# Altium schematic sheet MCU_board_3.SchDoc
size A4; SheetNumber: 3; SheetTotal: 3
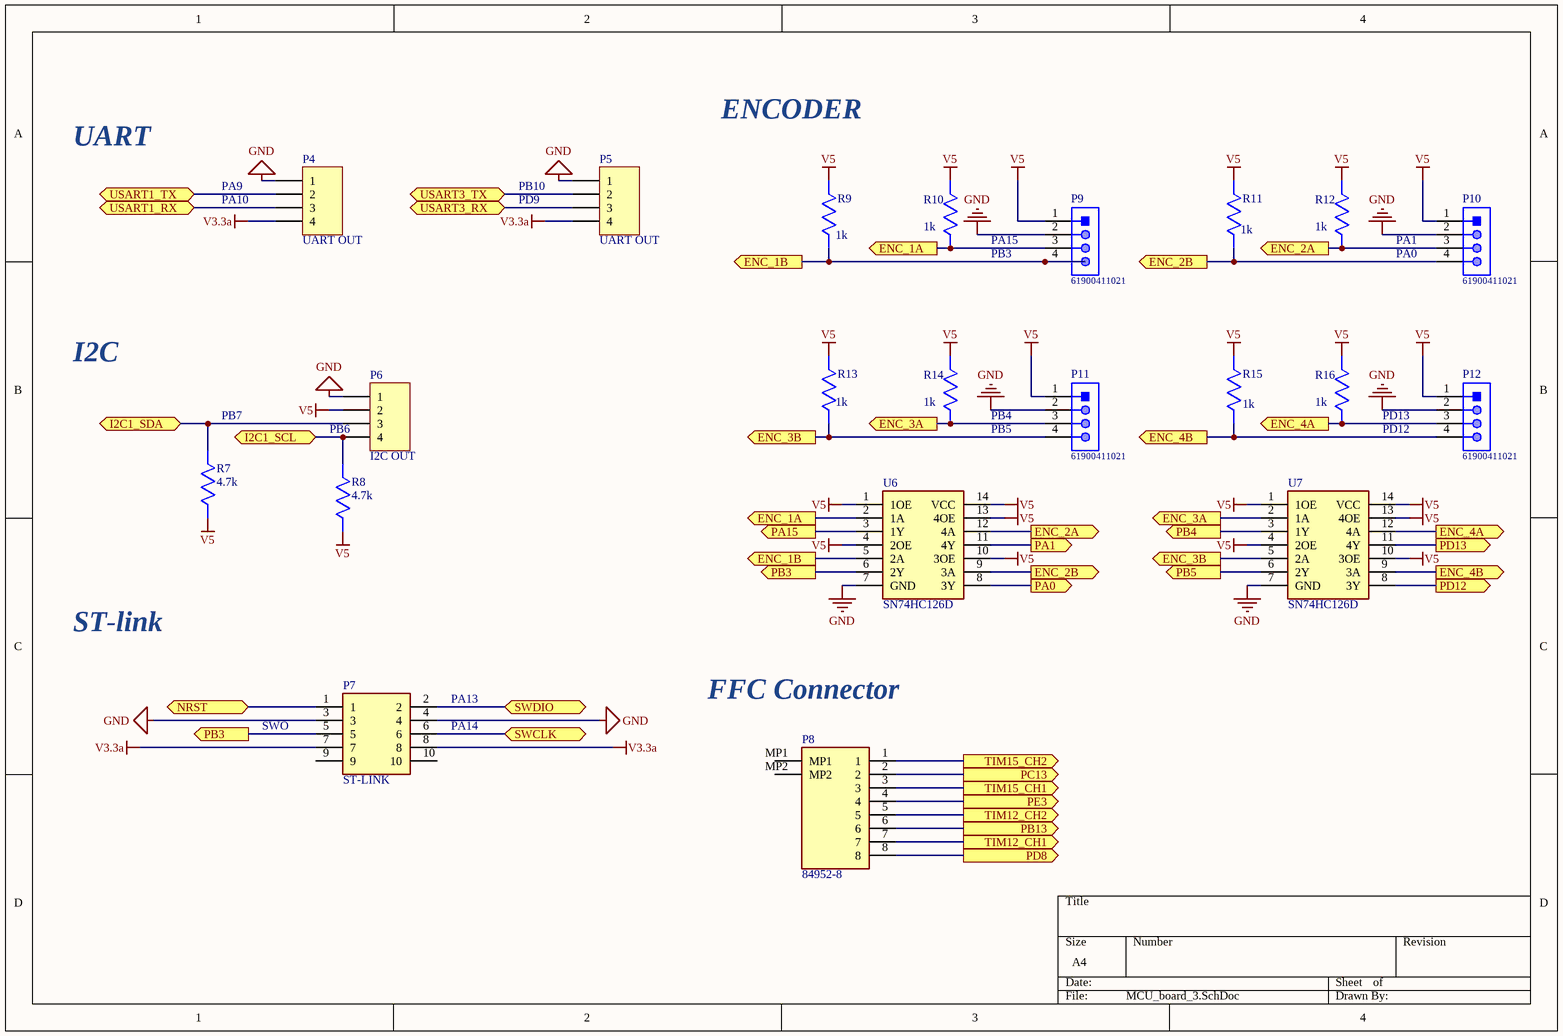
[diagram p0: MCU_board_3.SchDoc]

## Parts
P4  UART OUT  [HDR1X4]
P5  UART OUT  [HDR1X4]
P6  I2C OUT  [HDR1X4]
P7  ST-LINK  [SHDR10W66P254_2X5_2035X880X920P]
P8  84952-8  [849528]
P9  61900411021  [61900411021]
P10  61900411021  [61900411021]
P11  61900411021  [61900411021]
P12  61900411021  [61900411021]
R7  4.7k  [RESC1608X55N]
R8  4.7k  [RESC1608X55N]
R9  1k  [RESC1608X55N]
R10  1k  [RESC1608X55N]
R11  1k  [RESC1608X55N]
R12  1k  [RESC1608X55N]
R13  1k  [RESC1608X55N]
R14  1k  [RESC1608X55N]
R15  1k  [RESC1608X55N]
R16  1k  [RESC1608X55N]
U6  SN74HC126D  [SOIC127P600X175-14N]
U7  SN74HC126D  [SOIC127P600X175-14N]

## Ports
ENC_1A (out, see MCU_board_3[2C]), ENC_1A (out, see MCU_board_3[3A]), ENC_1B (out, see MCU_board_3[2B]), ENC_1B (out, see MCU_board_3[2C]), ENC_2A (out, see MCU_board_3[3C]), ENC_2A (out, see MCU_board_3[4A]), ENC_2B (out, see MCU_board_3[3B]), ENC_2B (out, see MCU_board_3[3C]), ENC_3A (out, see MCU_board_3[3B]), ENC_3A (out, see MCU_board_3[3C]), ENC_3B (out, see MCU_board_3[2B]), ENC_3B (out, see MCU_board_3[3C]), ENC_4A (out, see MCU_board_3[4B]), ENC_4A (out, see MCU_board_3[4C]), ENC_4B (out, see MCU_board_3[3B]), ENC_4B (out, see MCU_board_3[4C]), I2C1_SCL (bidir, see MCU_board_1[1D]), I2C1_SDA (bidir, see MCU_board_1[1D]), NRST (bidir, see MCU_board_1[3A], MCU_board_2[1C], MCU_board_2[2C]), PA0 (out, see MCU_board_1[1C]), PA1 (out, see MCU_board_1[1C]), PA15 (out, see MCU_board_1[1C]), PB3 (out, see MCU_board_1[1D], MCU_board_3[1C]), PB3 (out, see MCU_board_1[1D], MCU_board_3[2C]), PB4 (out, see MCU_board_1[1D]), PB5 (out, see MCU_board_1[1D]), PB13 (out, see MCU_board_1[1D]), PC13 (out, see MCU_board_1[2C]), PD8 (out, see MCU_board_1[2D]), PD12 (out, see MCU_board_1[2D]), PD13 (out, see MCU_board_1[2D]), PE3 (out, see MCU_board_1[2A]), SWCLK (bidir, see MCU_board_1[1C]), SWDIO (bidir, see MCU_board_1[1C]), TIM12_CH1 (out, see MCU_board_1[1D]), TIM12_CH2 (out, see MCU_board_1[1D]), TIM15_CH1 (out, see MCU_board_1[2A]), TIM15_CH2 (out, see MCU_board_1[2A]), USART1_RX (bidir, see MCU_board_1[1C], MCU_board_2[4C]), USART1_TX (bidir, see MCU_board_1[1C], MCU_board_2[4C]), USART3_RX (bidir, see MCU_board_1[2D]), USART3_TX (bidir, see MCU_board_1[1D])

## Nets
GND: P4.1 P5.1 P6.1 P7.3 P7.4 P9.2 P10.2 P11.2 P12.2 U6.7(GND) U7.7(GND)
V3.3a: P4.4 P5.4 P7.7 P7.8
V5: P6.2 P9.1 P10.1 P11.1 P12.1 R7.1 R8.1 R9.2 R10.2 R11.2 R12.2 R13.2 R14.2 R15.2 R16.2 U6.1(1OE) U6.4(2OE) U6.10(3OE) U6.13(4OE) U6.14(VCC) U7.1(1OE) U7.4(2OE) U7.10(3OE) U7.13(4OE) U7.14(VCC)
ENC_1A: P9.3 R10.1 U6.2(1A) ; port ENC_1A
ENC_1B: P9.4 R9.1 U6.5(2A) ; port ENC_1B
ENC_2A: P10.3 R12.1 U6.12(4A) ; port ENC_2A
ENC_2B: P10.4 R11.1 U6.9(3A) ; port ENC_2B
ENC_3A: P11.3 R14.1 U7.2(1A) ; port ENC_3A
ENC_3B: P11.4 R13.1 U7.5(2A) ; port ENC_3B
ENC_4A: P12.3 R16.1 U7.12(4A) ; port ENC_4A
ENC_4B: P12.4 R15.1 U7.9(3A) ; port ENC_4B
I2C1_SCL: P6.4 R8.2 ; port I2C1_SCL
I2C1_SDA: P6.3 R7.2 ; port I2C1_SDA
NRST: P7.1 ; port NRST
PA0: U6.8(3Y) ; port PA0
PA1: U6.11(4Y) ; port PA1
PA15: U6.3(1Y) ; port PA15
PB3: P7.5 U6.6(2Y) ; port PB3
PB4: U7.3(1Y) ; port PB4
PB5: U7.6(2Y) ; port PB5
PB13: P8.6 ; port PB13
PC13: P8.2 ; port PC13
PD8: P8.8 ; port PD8
PD12: U7.8(3Y) ; port PD12
PD13: U7.11(4Y) ; port PD13
PE3: P8.4 ; port PE3
SWCLK: P7.6 ; port SWCLK
SWDIO: P7.2 ; port SWDIO
TIM12_CH1: P8.7 ; port TIM12_CH1
TIM12_CH2: P8.5 ; port TIM12_CH2
TIM15_CH1: P8.3 ; port TIM15_CH1
TIM15_CH2: P8.1 ; port TIM15_CH2
USART1_RX: P4.3 ; port USART1_RX
USART1_TX: P4.2 ; port USART1_TX
USART3_RX: P5.3 ; port USART3_RX
USART3_TX: P5.2 ; port USART3_TX

Not connected (* = marked no-connect by the designer): P7 9 10; P8 MP1 MP2

## Notes on the sheet
- UART
- ENCODER
- PA9
- PA10
- PB10
- PD9
- PA15
- PA1
- PB3
- PA0
- I2C
- (near R7) PB7
- (near P6) PB6
- PB4
- PB5
- PD13
- PD12
- ST-link
- (near P7) PA13
- FFC Connector
- SWO
- (near P7) PA14

## Library data of the parts
P4-P6 = Header 4: Header, 4-Pin; LatestRevisionDate: 17-Jul-2002; LatestRevisionNote: Re-released for DXP Platform.; Publisher: Altium Limited
P7 = 1-1634688-0: Connector; Manufacturer_Name: TE Connectivity; Datasheet Link: https://componentsearchengine.com/Datasheets/2/1-1634688-0.pdf; Height: 9.2mm; Manufacturer_Part_Number: 1-1634688-0
P8 = 84952-8: Connector; Manufacturer_Name: TE Connectivity; Datasheet Link: https://www.te.com/commerce/DocumentDelivery/DDEController?Action=showdoc&DocId=Customer+Drawing%7F84952%7FA4%7Fpdf%7FEnglish%7FENG_CD_84952_A4.pdf%7F84952-8; Height: 2.74mm; Manufacturer_Part_Number: 84952-8; Mouser Part Number: 571-84952-8; Mouser Price/Stock: https://www.mouser.co.uk/ProductDetail/TE-Connectivity/84952-8?qs=uUkeXfjQ8uTKEYAHE0dNDQ%3D%3D; Arrow Part Number: 84952-8; Arrow Price/Stock: https://www.arrow.com/en/products/84952-8/te-connectivity?region=europe
P9-P12 = CMP-1502-00594-1: Male Bottom Locking Header WR-WTB, THT, Right Angled, pitch 2.54 mm, 1 x 4 position; Manufacturer: Wurth Elektronik; Position: 1x4; Working Voltage: 250VAC; Pitch: 2.54mm; Contact Resistance: 20mOhm; Part Number: 61900411021; Operating Temperature: -40to105degC; Orientation: RightAngled; Packaging: Bag; Datasheet URL: https://katalog.we-online.de/em/datasheet/6190xx11021.pdf; Package Reference: 61900411021; Publisher: WurthElektronik; Mounting Technology: THT; Manufacturer URL: http://www.we-online.de; Gender: Male
R7-R16 = CMP0603-FX-1003ELF: Resistor; Manufacturer_Name: Bourns; Datasheet Link: https://www.mouser.co.uk/datasheet/2/54/Bourns_CMP_Datasheet_05.28.20-1854233.pdf; Height: 0.55mm; Manufacturer_Part_Number: CMP0603-FX-1003ELF
U6 U7 = SN74HC126D: Integrated Circuit; Manufacturer_Name: Texas Instruments; Datasheet Link: http://www.ti.com/lit/gpn/sn74hc126; Height: 1.75mm; Manufacturer_Part_Number: SN74HC126D; Mouser Part Number: 595-SN74HC126D; Mouser Price/Stock: https://www.mouser.co.uk/ProductDetail/Texas-Instruments/SN74HC126D?qs=FM6NhYOeeBWM0b9Ig2w%252BaQ%3D%3D; Arrow Part Number: SN74HC126D; Arrow Price/Stock: https://www.arrow.com/en/products/sn74hc126d/texas-instruments